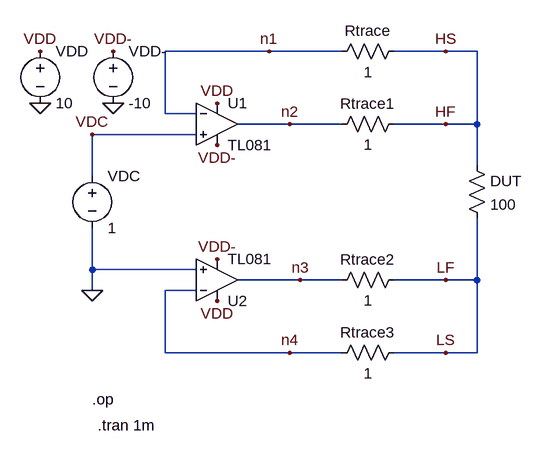
[diagram p0: schematic Lab 2 Experiment 6b.asc]
Lab 2 Experiment 6b.asc, the LTspice schematic file:
Version 4
SHEET 1 880 680
WIRE 272 -64 112 -64
WIRE 384 -64 272 -64
WIRE 544 -64 464 -64
WIRE 592 -64 544 -64
WIRE 112 32 112 -64
WIRE 160 32 112 32
WIRE 304 48 224 48
WIRE 384 48 304 48
WIRE 544 48 464 48
WIRE 592 48 592 -64
WIRE 592 48 544 48
WIRE 160 64 0 64
WIRE 592 112 592 48
WIRE 0 128 0 64
WIRE 0 272 0 208
WIRE 160 272 0 272
WIRE 320 288 224 288
WIRE 384 288 320 288
WIRE 544 288 464 288
WIRE 592 288 592 192
WIRE 592 288 544 288
WIRE 0 304 0 272
WIRE 160 304 112 304
WIRE 112 400 112 304
WIRE 304 400 112 400
WIRE 384 400 304 400
WIRE 544 400 464 400
WIRE 592 400 592 288
WIRE 592 400 544 400
FLAG -80 16 0
FLAG 32 16 0
FLAG -80 -64 VDD
FLAG 32 -64 VDD-
FLAG 192 256 VDD-
FLAG 192 80 VDD-
FLAG 192 16 VDD
FLAG 192 320 VDD
FLAG 0 64 VDC
FLAG 544 -64 HS
FLAG 544 48 HF
FLAG 544 400 LS
FLAG 544 288 LF
FLAG 272 -64 n1
FLAG 304 48 n2
FLAG 320 288 n3
FLAG 304 400 n4
FLAG 0 304 0
SYMBOL voltage 0 112 R0
WINDOW 123 0 0 Left 0
WINDOW 39 0 0 Left 0
SYMATTR InstName VDC
SYMATTR Value 1
SYMBOL AutoGenerated\\TL081 192 -16 R0
SYMATTR InstName U1
SYMBOL AutoGenerated\\TL081 192 352 M180
SYMATTR InstName U2
SYMBOL res 480 -80 R90
WINDOW 0 0 56 VBottom 2
WINDOW 3 32 56 VTop 2
SYMATTR InstName Rtrace
SYMATTR Value 1
SYMBOL res 480 32 R90
WINDOW 0 0 56 VBottom 2
WINDOW 3 32 56 VTop 2
SYMATTR InstName Rtrace1
SYMATTR Value 1
SYMBOL res 480 272 R90
WINDOW 0 0 56 VBottom 2
WINDOW 3 32 56 VTop 2
SYMATTR InstName Rtrace2
SYMATTR Value 1
SYMBOL res 480 384 R90
WINDOW 0 0 56 VBottom 2
WINDOW 3 32 56 VTop 2
SYMATTR InstName Rtrace3
SYMATTR Value 1
SYMBOL res 576 96 R0
SYMATTR InstName DUT
SYMATTR Value 100
SYMBOL voltage -80 -80 R0
WINDOW 123 0 0 Left 0
WINDOW 39 0 0 Left 0
SYMATTR InstName VDD
SYMATTR Value 10
SYMBOL voltage 32 -80 R0
WINDOW 123 0 0 Left 0
WINDOW 39 0 0 Left 0
SYMATTR InstName VDD-
SYMATTR Value -10
TEXT 0 472 Left 2 !.op
TEXT 8 512 Left 2 !.tran 1m

The netlist it stands for:
* Lab 2 Experiment 6b.asc
VDC VDC 0 1
* U1: TL081 (symbol AutoGenerated\TL081 not available, pins judged from their places): In+=VDC In-=n1 V+=VDD V-=VDD- OUT=n2
* U2: TL081 (symbol AutoGenerated\TL081 not available, pins judged from their places): In+=0 In-=n4 V+=VDD V-=VDD- OUT=n3
Rtrace HF n1 1
Rtrace1 HF n2 1
Rtrace2 LF n3 1
Rtrace3 LF n4 1
R§DUT HF LF 100
VDD VDD 0 10
VDD- VDD- 0 -10
.op
.tran 1m
.backanno
.end